# EAGLE design modularArduinoClouds3 (EAGLE 9.1.0)
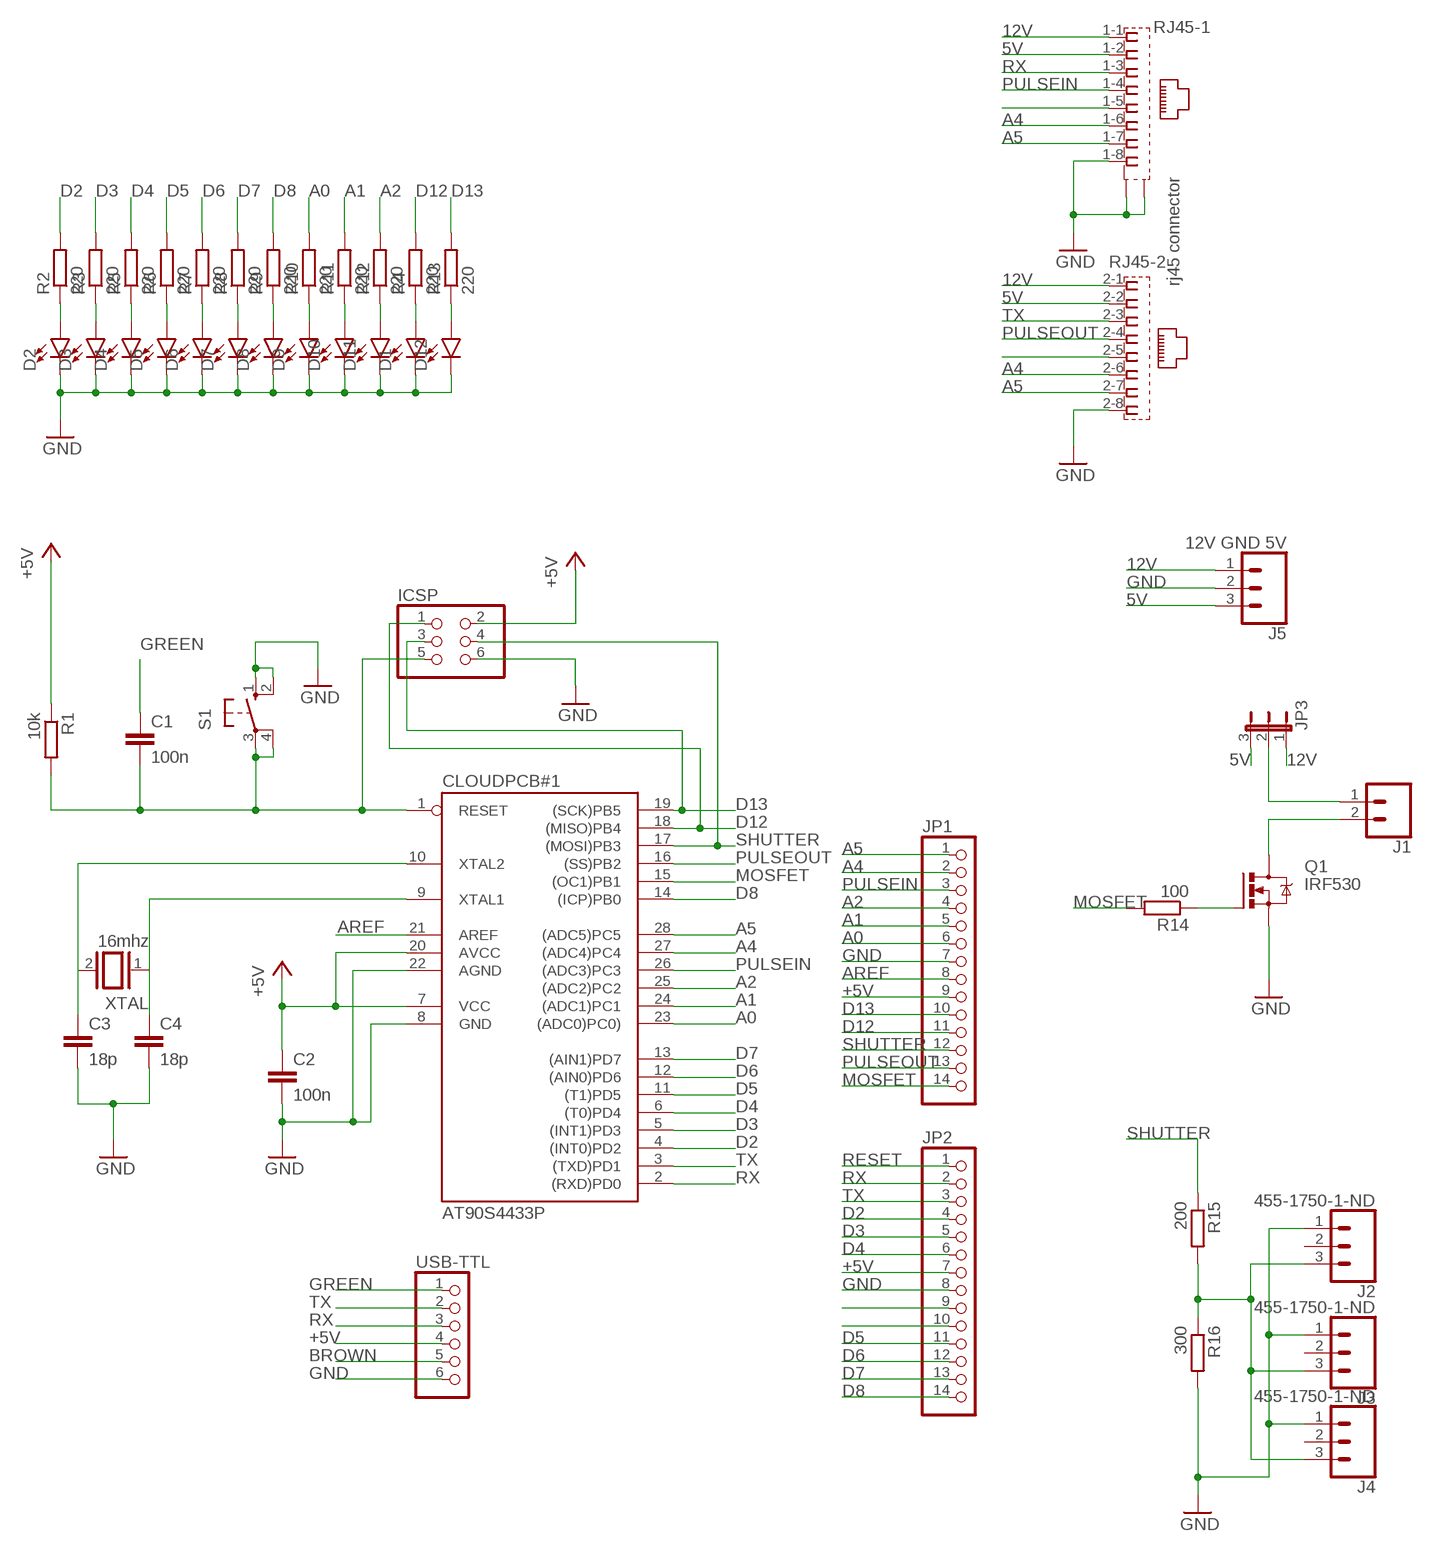
[diagram p0: schematic, sheet 1]

## Parts
C1  100n  C-EU050-025X075  [C050-025X075]
C2  100n  C-EU050-025X075  [C050-025X075]
C3  18p  C-EU050-025X075  [C050-025X075]
C4  18p  C-EU050-025X075  [C050-025X075]
CLOUDPCB#1  AT90S4433P  [DIL28-3]
D1  LED5MM  [LED_5MM]
D2  LED5MM  [LED_5MM]
D3  LED5MM  [LED_5MM]
D4  LED5MM  [LED_5MM]
D5  LED5MM  [LED_5MM]
D6  LED5MM  [LED_5MM]
D7  LED5MM  [LED_5MM]
D8  LED5MM  [LED_5MM]
D9  LED5MM  [LED_5MM]
D10  LED5MM  [LED_5MM]
D11  LED5MM  [LED_5MM]
D12  LED5MM  [LED_5MM]
ICSP  PINHD-2X3  [2X03]
J1  CONN_02  [1X02]
J2  455-1750-1-ND  CONN_03  [1X03]
J3  455-1750-1-ND  CONN_03  [1X03]
J4  455-1750-1-ND  CONN_03  [1X03]
J5  12V GND 5V  CONN_03  [1X03]
JP1  PINHD-1X14  [1X14]
JP2  PINHD-1X14  [1X14]
JP3  JP2E  [JP2]
Q1  IRF530  [TO220BV]
R1  10k  R-EU_0207/10  [0207/10]
R2  220  R-EU_0207/10  [0207/10]
R3  220  R-EU_0207/10  [0207/10]
R4  220  R-EU_0207/10  [0207/10]
R5  220  R-EU_0207/10  [0207/10]
R6  220  R-EU_0207/10  [0207/10]
R7  220  R-EU_0207/10  [0207/10]
R8  220  R-EU_0207/10  [0207/10]
R9  220  R-EU_0207/10  [0207/10]
R10  220  R-EU_0207/10  [0207/10]
R11  220  R-EU_0207/10  [0207/10]
R12  220  R-EU_0207/10  [0207/10]
R13  220  R-EU_0207/10  [0207/10]
R14  100  R-EU_0207/10  [0207/10]
R15  200  R-EU_0207/10  [0207/10]
R16  300  R-EU_0207/10  [0207/10]
RJ45  557570-1  [557570-1]
S1  10-XX  [B3F-10XX]
USB-TTL  PINHD-1X6  [1X06]
XTAL  16mhz  XTAL/S  [QS]

## Nets
5V: J5.3 JP3.3 RJ45.1-2 RJ45.2-2
12V: J5.1 JP3.1 RJ45.1-1 RJ45.2-1
+5V: C2.1 CLOUDPCB#1.7(VCC) CLOUDPCB#1.20(AVCC) ICSP.2 JP1.9 JP2.7 R1.1 USB-TTL.4
A0: CLOUDPCB#1.23((ADC0)PC0)) JP1.6 R10.2
A1: CLOUDPCB#1.24((ADC1)PC1) JP1.5 R11.2
A2: CLOUDPCB#1.25((ADC2)PC2) JP1.4 R12.2
A4: CLOUDPCB#1.27((ADC4)PC4) JP1.2 RJ45.1-6 RJ45.2-6
A5: CLOUDPCB#1.28((ADC5)PC5) JP1.1 RJ45.1-7 RJ45.2-7
AREF: CLOUDPCB#1.21(AREF) JP1.8
BROWN: USB-TTL.5
D2: CLOUDPCB#1.4((INT0)PD2) JP2.4 R2.2
D3: CLOUDPCB#1.5((INT1)PD3) JP2.5 R3.2
D4: CLOUDPCB#1.6((T0)PD4) JP2.6 R5.2
D5: CLOUDPCB#1.11((T1)PD5) JP2.11 R6.2
D6: CLOUDPCB#1.12((AIN0)PD6) JP2.12 R7.2
D7: CLOUDPCB#1.13((AIN1)PD7) JP2.13 R8.2
D8: CLOUDPCB#1.14((ICP)PB0) JP2.14 R9.2
D12: CLOUDPCB#1.18((MISO)PB4) ICSP.1 JP1.11 R4.2
D13: CLOUDPCB#1.19((SCK)PB5) ICSP.3 JP1.10 R13.2
GND: C2.2 C3.2 C4.2 CLOUDPCB#1.8(GND) CLOUDPCB#1.22(AGND) D1.K(C) D2.K(C) D3.K(C) D4.K(C) D5.K(C) D6.K(C) D7.K(C) D8.K(C) D9.K(C) D10.K(C) D11.K(C) D12.K(C) ICSP.6 J2.1 J3.1 J4.1 J5.2 JP1.7 JP2.8 Q1.S R16.2 RJ45.1-8 RJ45.2-8 RJ45.G1(-1:S2) RJ45.G3(-1:S1) S1.1(S) S1.2(S1) USB-TTL.6
GREEN: C1.1 USB-TTL.1
MOSFET: CLOUDPCB#1.15((OC1)PB1) JP1.14 R14.2
N$1: D2.A R2.1
N$2: D3.A R3.1
N$3: C3.1 CLOUDPCB#1.10(XTAL2) XTAL.2
N$4: C4.1 CLOUDPCB#1.9(XTAL1) XTAL.1
N$5: RJ45.2-5
N$6: J1.2 Q1.D
N$7: D4.A R5.1
N$8: D5.A R6.1
N$9: D6.A R7.1
N$10: D7.A R8.1
N$11: D8.A R9.1
N$12: D9.A R10.1
N$13: D10.A R11.1
N$14: D11.A R12.1
N$15: JP2.9
N$16: JP2.10
N$18: Q1.G R14.1
N$19: J1.1 JP3.2
N$20: J2.3 J3.3 J4.3 R15.2 R16.1
N$28: RJ45.1-5
N$33: D1.A R4.1
N$35: D12.A R13.1
PULSEIN: CLOUDPCB#1.26((ADC3)PC3) JP1.3 RJ45.1-4
PULSEOUT: CLOUDPCB#1.16((SS)PB2) JP1.13 RJ45.2-4
RESET: C1.2 CLOUDPCB#1.1(RESET) ICSP.5 JP2.1 R1.2 S1.3(P) S1.4(P1)
RX: CLOUDPCB#1.2((RXD)PD0) JP2.2 RJ45.1-3 USB-TTL.3
SHUTTER: CLOUDPCB#1.17((MOSI)PB3) ICSP.4 JP1.12 R15.1
TX: CLOUDPCB#1.3((TXD)PD1) JP2.3 RJ45.2-3 USB-TTL.2
Unconnected: J2.2 J3.2 J4.2

## Notes on the sheet
- rj45 connector

## Library data of the parts
C1-C4 = rcl:C-EU: CAPACITOR, European symbol; SPICEPREFIX: C
CLOUDPCB#1 = atmel:AT90S4433: MICROCONTROLLER 4 Kbytes FLASH 128 bytes SRAM 256 bytes EEPROM UART 6-channel 10 bit ADC; OC_FARNELL: unknown; OC_NEWARK: unknown
D1-D12 = SparkFun-LED:LED: LED (Generic) Standard schematic elements and footprints for 5mm, 3mm, 1206, and 0603 sized LEDs. Generic LEDs with no color specified.; SPICEPREFIX: D
ICSP = SparkFun-Connectors:PINHD-2X3: PIN HEADER
J1 = SparkFun-Connectors:CONN_02: Multi connection point. Often used as Generic Header-pin footprint for 0.1 inch spaced/style header connections On any of the 0.1 inch spaced packages, you can populate with these: Break Away Headers - Straight <https://www.sparkfun.com/products/116> (PRT-00116) Break Away Male Headers - Right Angle <https://www.sparkfun.com/products/553> (PRT-00553) Female Headers <https://www.sparkfun.com/products/115> (PRT-00115) Break Away Headers - Machine Pin <https://www.sparkfun.com/products/117> (PRT-00117) Break Away Female Headers - Swiss Machine Pin <https://www.sparkfun.com/products/743> (PRT-00743) For SCREWTERMINALS and SPRING TERMINALS visit here: Screw Terimnals on SparkFun.com <https://www.sparkfun.com/search/results?term=Screw+Terminals> (5mm/3.5mm/2.54mm spacing) This device is also useful as a general connection point to wire up your design to another part of your project. Our various solder wires solder well into these plated through hole pads. Hook-Up Wire - Assortment (Stranded, 22 AWG) <https://www.sparkfun.com/products/11375> (PRT-11375) Hook-Up Wire - Assortment (Solid Core, 22 AWG) <https://www.sparkfun.com/products/11367> (PRT-11367) View the entire wire category on our website here <https://www.sparkfun.com/categories/141> Special notes: Molex polarized connector foot print use with: PRT-08233 with associated crimp pins and housings. 2.54_SCREWTERM for use with PRT-10571. 3.5mm Screw Terminal footprints for PRT-08084 5mm Screw Terminal footprints for use with PRT-08432
J2-J4 = SparkFun-Connectors:CONN_03: Multi connection point. Often used as Generic Header-pin footprint for 0.1 inch spaced/style header connections On any of the 0.1 inch spaced packages, you can populate with these: Break Away Headers - Straight <https://www.sparkfun.com/products/116> (PRT-00116) Break Away Male Headers - Right Angle <https://www.sparkfun.com/products/553> (PRT-00553) Female Headers <https://www.sparkfun.com/products/115> (PRT-00115) Break Away Headers - Machine Pin <https://www.sparkfun.com/products/117> (PRT-00117) Break Away Female Headers - Swiss Machine Pin <https://www.sparkfun.com/products/743> (PRT-00743) Stackable Header - 3 Pin (Female, 0.1") <https://www.sparkfun.com/products/13875> (PRT-13875) For SCREWTERMINALS and SPRING TERMINALS visit here: Screw Terimnals on SparkFun.com <https://www.sparkfun.com/search/results?term=Screw+Terminals> (5mm/3.5mm/2.54mm spacing) This device is also useful as a general connection point to wire up your design to another part of your project. Our various solder wires solder well into these plated through hole pads. Hook-Up Wire - Assortment (Stranded, 22 AWG) <https://www.sparkfun.com/products/11375> (PRT-11375) Hook-Up Wire - Assortment (Solid Core, 22 AWG) <https://www.sparkfun.com/products/11367> (PRT-11367) View the entire wire category on our website here <https://www.sparkfun.com/categories/141> Special notes: Molex polarized connector foot print use with SKU : PRT-08232 with associated crimp pins and housings.; PROD_ID: XXX-00000
J5 = SparkFun-Connectors:CONN_03: Multi connection point. Often used as Generic Header-pin footprint for 0.1 inch spaced/style header connections On any of the 0.1 inch spaced packages, you can populate with these: Break Away Headers - Straight <https://www.sparkfun.com/products/116> (PRT-00116) Break Away Male Headers - Right Angle <https://www.sparkfun.com/products/553> (PRT-00553) Female Headers <https://www.sparkfun.com/products/115> (PRT-00115) Break Away Headers - Machine Pin <https://www.sparkfun.com/products/117> (PRT-00117) Break Away Female Headers - Swiss Machine Pin <https://www.sparkfun.com/products/743> (PRT-00743) Stackable Header - 3 Pin (Female, 0.1") <https://www.sparkfun.com/products/13875> (PRT-13875) For SCREWTERMINALS and SPRING TERMINALS visit here: Screw Terimnals on SparkFun.com <https://www.sparkfun.com/search/results?term=Screw+Terminals> (5mm/3.5mm/2.54mm spacing) This device is also useful as a general connection point to wire up your design to another part of your project. Our various solder wires solder well into these plated through hole pads. Hook-Up Wire - Assortment (Stranded, 22 AWG) <https://www.sparkfun.com/products/11375> (PRT-11375) Hook-Up Wire - Assortment (Solid Core, 22 AWG) <https://www.sparkfun.com/products/11367> (PRT-11367) View the entire wire category on our website here <https://www.sparkfun.com/categories/141> Special notes: Molex polarized connector foot print use with SKU : PRT-08232 with associated crimp pins and housings.; PROD_ID: XXX-00000; VALUE: 455-1750-1-ND
JP1 JP2 = pinhead:PINHD-1X14: PIN HEADER
JP3 = jumper:JP2E: JUMPER
Q1 = transistor-power:IRF530: HEXFET Power MOSFET
R1-R16 = rcl:R-EU_: RESISTOR, European symbol; SPICEPREFIX: R
RJ45 = con-amp:557570-1: AMP connector
S1 = switch-omron:10-XX: OMRON SWITCH; MPN: B3F-1000; OC_FARNELL: 176432; OC_NEWARK: 36M3542
USB-TTL = pinhead:PINHD-1X6: PIN HEADER
XTAL = special:XTAL/S: CRYSTAL

## Board
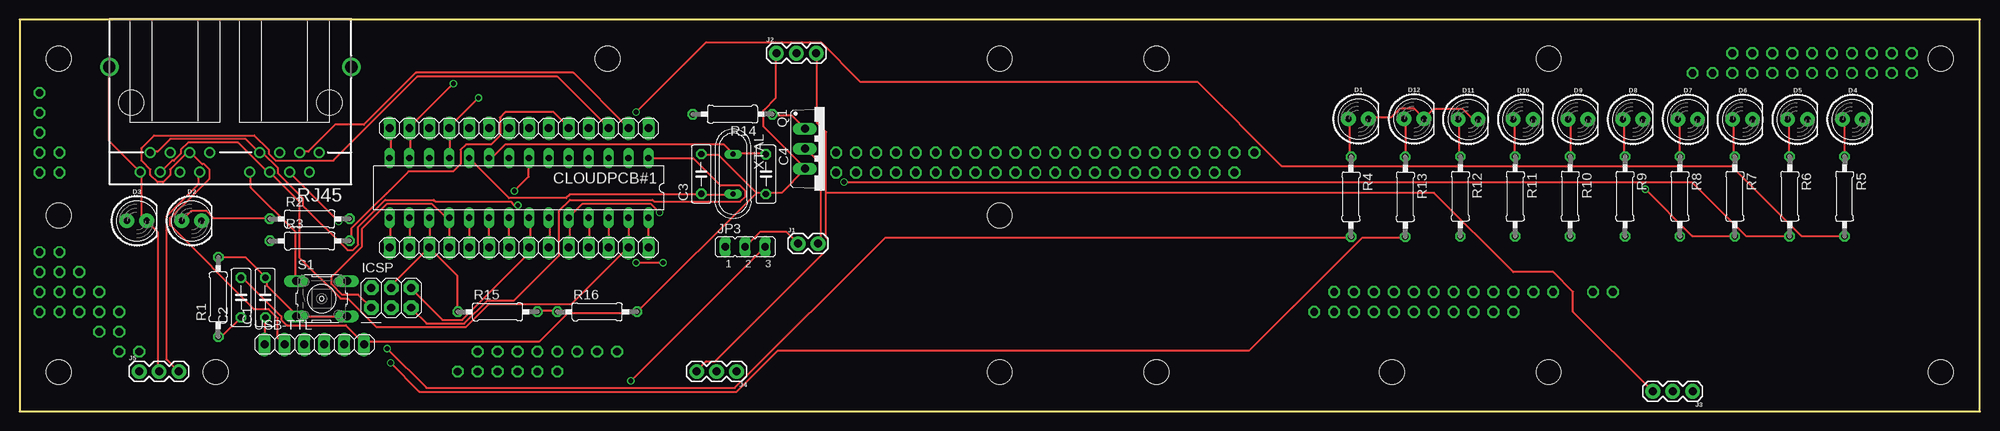
[diagram p1: board, top side]
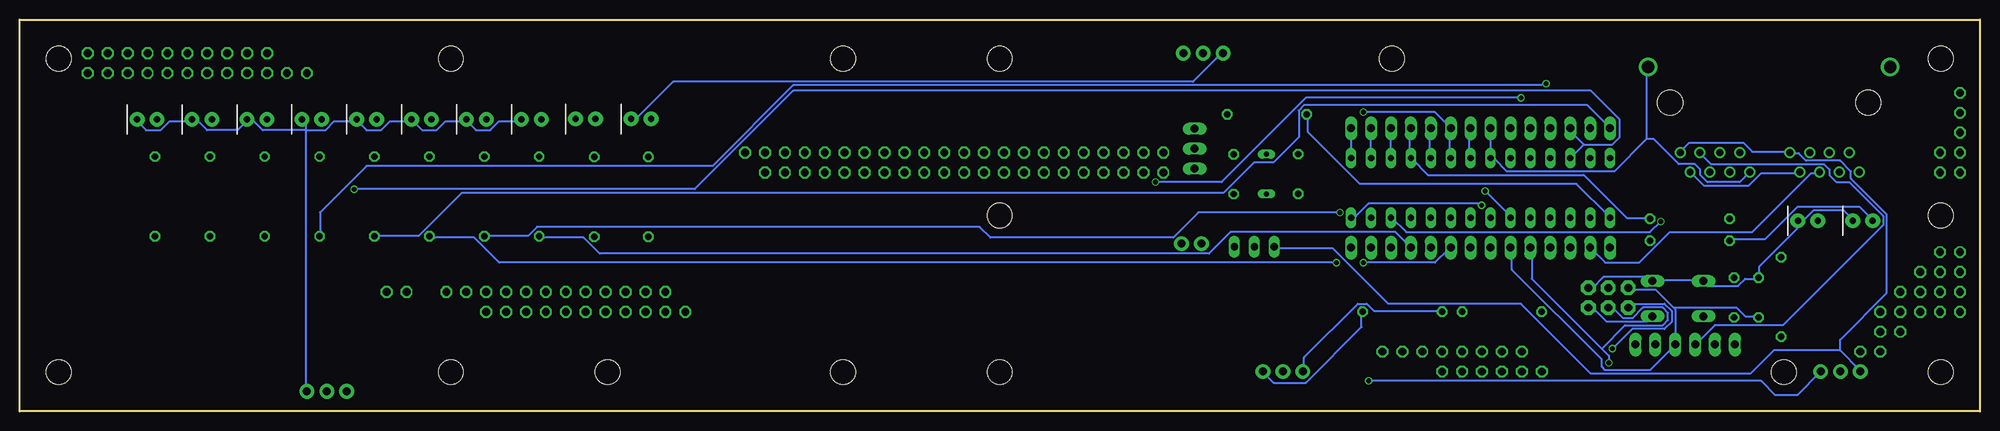
[diagram p2: board, bottom side, seen from below]

Size 250 x 50 mm. Coordinates in mm from the lower left corner, seen from the top.
Outline: 0,0 250,0
Outline: 250,0 250,50 0,50 0,0
Outline: 0,0 250,0
Copper layers (1*16): Top 0.035mm / dielectric 1.5mm / Bottom 0.035mm
Design rules "SeeedStudio_2layer_DRU_no_angle_20140221": minimum track width 6mil, minimum drill 12mil, track to track 6mil, track to pad 6mil, pad to pad 6mil, via to via 6mil, smd to smd 0mil, copper to edge 10mil, drill to drill 10mil, minimum pad ring 10mil, minimum via ring 6mil, stop-mask expansion 2mil, vias tented up to drill 100mil, thermal gap 10mil
Holes 3.2 mm at 5,5 5,25 5,45 125,5 125,25 125,45 245,5 245,45 195,45 75,45 195,5 175,5 25,5 145,5 145,45

### Footprints (pad centres in the part's own frame; a part is rotated, then mirrored left to right if it is on the bottom)
C050-025X075 = drill 0.813 octagon: 1 -2.54,0; 2 2.54,0
DIL28-3 = drill 0.813 long: 1 -16.51,-3.81; 2 -13.97,-3.81; 3 -11.43,-3.81; 4 -8.89,-3.81; 5 -6.35,-3.81; 6 -3.81,-3.81; 7 -1.27,-3.81; 8 1.27,-3.81; 9 3.81,-3.81; 10 6.35,-3.81; 11 8.89,-3.81; 12 11.43,-3.81; 13 13.97,-3.81; 14 16.51,-3.81; 15 16.51,3.81; 16 13.97,3.81; 17 11.43,3.81; 18 8.89,3.81; 19 6.35,3.81; 20 3.81,3.81; 21 1.27,3.81; 22 -1.27,3.81; 23 -3.81,3.81; 24 -6.35,3.81; 25 -8.89,3.81; 26 -11.43,3.81; 27 -13.97,3.81; 28 -16.51,3.81
LED_5MM = drill 0.813 pad 1.88: A -1.27,0; K 1.27,0
2X03 = drill 1.016 pad 1.88 octagon: 1 -2.54,-1.27; 2 -2.54,1.27; 3 0,-1.27; 4 0,1.27; 5 2.54,-1.27; 6 2.54,1.27
1X02 = drill 1.016 pad 1.88: 1 0,0; 2 2.54,0
1X03 = drill 1.016 pad 1.88: 1 0,0; 2 2.54,0; 3 5.08,0
1X14 = drill 1.016 long: 1 -16.51,0; 2 -13.97,0; 3 -11.43,0; 4 -8.89,0; 5 -6.35,0; 6 -3.81,0; 7 -1.27,0; 8 1.27,0; 9 3.81,0; 10 6.35,0; 11 8.89,0; 12 11.43,0; 13 13.97,0; 14 16.51,0
JP2 = drill 0.914 long: 1 -2.54,0; 2 0,0; 3 2.54,0
TO220BV = drill 1.016 long: D 0,-2.54; G -2.54,-2.54; S 2.54,-2.54
0207/10 = drill 0.813 octagon: 1 -5.08,0; 2 5.08,0
557570-1 = drill 0.889: 1-1 -11.43,6.35; 1-2 -10.16,8.89; 1-3 -8.89,6.35; 1-4 -7.62,8.89; 1-5 -6.35,6.35; 1-6 -5.08,8.89; 1-7 -3.81,6.35; 1-8 -2.54,8.89; 2-1 2.54,6.35; 2-2 3.81,8.89; 2-3 5.08,6.35; 2-4 6.35,8.89; 2-5 7.62,6.35; 2-6 8.89,8.89; 2-7 10.16,6.35; 2-8 11.43,8.89 | drill 1.575 pad 2.184: G1 -15.494,-4.572; G3 15.367,-4.572 | hole 3.251: -12.7,0; 12.573,0
B3F-10XX = drill 1.016 long: 1 -3.251,2.261; 2 3.251,2.261; 3 -3.251,-2.261; 4 3.251,-2.261
1X06 = drill 1.016 long: 1 -6.35,0; 2 -3.81,0; 3 -1.27,0; 4 1.27,0; 5 3.81,0; 6 6.35,0
QS = drill 0.61 long: 1 -2.54,0; 2 2.54,0

### Placement (x,y rotation side)
C1  31.34,14.52 90 top
C2  28.24,14.52 90 top
C3  86.94,30.29 90 top
C4  95.17,30.27 270 top
CLOUDPCB#1  63.68,28.51 180 top
D1  170.74,37.32 0 top
D2  21.94,24.32 0 top
D3  14.94,24.32 0 top
D4  233.74,37.26 0 top
D5  226.74,37.26 0 top
D6  219.74,37.26 0 top
D7  212.74,37.26 0 top
D8  205.74,37.26 0 top
D9  198.74,37.26 0 top
D10  191.74,37.26 0 top
D11  184.74,37.26 0 top
D12  177.82,37.32 0 top
ICSP  47.4,14.5 0 top
J1  99.28,21.4 0 top
J2  96.52,45.72 0 top
J3  213.36,2.54 180 top
J4  91.44,5.08 180 top
J5  15.24,5.08 0 top
JP1  63.68,20.89 180 top
JP2  63.68,36.13 180 top
JP3  92.54,21 0 top
Q1  102.68,33.52 270 top
R1  25.34,14.59 90 top
R2  37,24.56 0 top
R3  37,21.75 0 top
R4  169.8,27.38 270 top
R5  232.74,27.44 270 top
R6  225.74,27.44 270 top
R7  218.74,27.44 270 top
R8  211.74,27.44 270 top
R9  204.74,27.44 270 top
R10  197.74,27.44 270 top
R11  190.74,27.44 270 top
R12  183.74,27.44 270 top
R13  176.72,27.38 270 top
R14  90.92,37.92 180 top
R15  60.96,12.7 0 top
R16  73.66,12.7 0 top
RJ45  26.8,39.4 180 top
S1  38.51,14.38 0 top
USB-TTL  37.59,8.54 0 top
XTAL  91,30.29 270 top

### Tracks (layer width: path | path; a pad name or v marks a point on that pad's centre or on a via)
5V  (via drill 0.61)
  Top 0.254: v77.95,3.89 94.87,20.8 JP3.3 | RJ45.2-2 22.86,30.4 22.86,29.03 18.75,24.92 18.75,6.63 20.12,5.26 J5.3
  Bottom 0.254: RJ45.2-2 23.09,30.4 27.89,30.4 29.49,28.8 35.2,28.8 36.8,30.4 RJ45.1-2 | v77.95,3.89 27.89,3.89 26.06,2.06 23.32,2.06 20.34,5.03 J5.3
12V
  Bottom 0.254: RJ45.1-1 38.18,33.15 37.03,34.29 30.18,34.29 29.03,33.15 24.46,33.15 RJ45.2-1 24.23,32.92 23.09,32.92 22.17,32 17.83,32 16.46,30.63 16.46,29.72 11.89,25.15 11.89,15.09 17.83,9.14 17.83,7.77 | 17.83,7.77 26.29,7.77 29.26,4.8 49.61,4.8 58.52,13.72 75.44,13.72 82.53,20.8 89.84,20.8 JP3.1 | 17.83,7.77 15.32,5.26 J5.1
+5V  (via drill 0.61)
  Top 0.254: R1.1 25.38,9.6 25.83,9.6 28.12,11.89 C2.1 | CLOUDPCB#1.20 59.89,24.69 59.89,21.03 JP1.9 | v63.09,28.12 64.92,29.95 64.92,32.23 CLOUDPCB#1.7
  Bottom 0.254: CLOUDPCB#1.7 65.15,32.46 65.15,36.12 JP2.7 | 39.09,13.26 41.38,15.54 44.81,15.54 ICSP.2 | 39.09,13.26 38.86,13.03 38.86,8.69 USB-TTL.4 38.86,8.46 42.06,5.26 47.78,5.26 48.23,5.71 48.23,6.63 59.66,18.06 59.66,20.8 JP1.9 | v63.09,28.12 59.89,24.92 CLOUDPCB#1.20 | 39.09,13.26 31.09,13.26 29.95,12.12 28.35,12.12 C2.1
A0  (via drill 0.61)
  Top 0.254: CLOUDPCB#1.23 67.67,24.69 67.67,21.03 JP1.6 | v78.64,18.97 v82.07,18.97
  Bottom 0.254: v82.07,18.97 188.82,18.97 192.02,22.17 197.74,22.17 R10.2 | v78.64,18.97 69.49,18.97 67.67,20.8 JP1.6
A1  (via drill 0.61)
  Top 0.254: JP1.5 70.18,21.03 70.18,24.69 CLOUDPCB#1.24 70.18,24.92 71.78,26.52 80.47,26.52 v81.61,25.38
  Bottom 0.254: v81.61,25.38 99.67,25.38 102.87,22.17 126.19,22.17 127.56,23.55 184.02,23.55 185.17,22.4 190.65,22.4 R11.2
A2
  Top 0.254: CLOUDPCB#1.25 72.69,24.69 72.69,21.03 JP1.4
  Bottom 0.254: R12.2 183.57,22.17 178.08,22.17 176.02,20.12 98.3,20.12 95.56,22.86 74.52,22.86 72.69,21.03 JP1.4
A4
  Top 0.254: CLOUDPCB#1.27 77.72,24.69 77.72,21.03 JP1.2 77.5,20.8 70.41,13.72 59.89,13.72 56.92,10.74 45.49,10.74 41.83,14.4 40.92,14.4 35.66,19.66 35.66,26.75 32,30.4 RJ45.1-6 31.77,30.4 27.89,34.29 21.49,34.29 20.57,33.38 20.57,32.92 19.66,32 19.43,32 18.06,30.63 RJ45.2-6
A5  (via drill 0.61)
  Top 0.254: CLOUDPCB#1.28 80.24,24.69 80.24,21.03 JP1.1 | RJ45.2-7 16.69,33.15 17.6,33.15 19.2,34.75 28.8,34.75 30.4,33.15 RJ45.1-7 30.63,32.92 31.09,32.92 32.92,31.09 32.92,30.4 36.12,27.2 36.12,26.29 41.83,20.57 42.52,20.57 43.2,21.26 43.2,23.55 46.63,26.98 52.81,26.98 53.03,26.75 62.64,26.75 63.09,26.29 v63.55,26.29
  Bottom 0.254: v63.55,26.29 63.78,26.52 77.95,26.52 79.55,24.92 80.01,24.92 CLOUDPCB#1.28
AREF
  Top 0.254: CLOUDPCB#1.21 62.41,21.03 JP1.8
D2
  Bottom 0.254: R2.2 42.29,24.69 45.03,24.69 50.52,30.18 70.41,30.18 72.47,32.23 CLOUDPCB#1.4 72.69,32.46 72.69,36.12 JP2.4
D3
  Top 0.254: R3.2 42.29,21.95 42.29,23.32 49.61,30.63 55.32,30.63 56.24,31.55 56.24,33.38 56.92,34.06 60.12,34.06 61.27,35.2 61.27,37.49 61.95,38.18 68.12,38.18 69.95,36.35 JP2.5
  Bottom 0.254: CLOUDPCB#1.5 70.18,32.46 70.18,36.12 JP2.5
D4  (via drill 0.61)
  Top 0.254: v78.64,38.18 87.55,47.09 102.18,47.09 107.21,42.06 150.19,42.06 160.93,31.32 218.31,31.32 227.23,22.4 232.72,22.4 R5.2
  Bottom 0.254: v78.64,38.18 69.49,38.18 67.67,36.35 JP2.6 67.67,36.12 67.67,32.46 CLOUDPCB#1.6
D5  (via drill 0.61)
  Top 0.254: v105.16,29.26 213.28,29.26 220.14,22.4 225.63,22.4 R6.2 | v58.52,40.01 54.86,36.35 JP2.11 54.86,36.12 54.86,32.46 CLOUDPCB#1.11
  Bottom 0.254: v105.16,29.26 96.7,29.26 85.95,40.01 v58.52,40.01
D6  (via drill 0.61)
  Top 0.254: v207.34,28.35 213.28,22.4 218.54,22.4 R7.2
  Bottom 0.254: v207.34,28.35 163.91,28.35 151.33,40.92 49.61,40.92 45.95,37.26 45.95,34.98 46.86,34.06 50.52,34.06 | 50.52,34.06 52.12,32.46 CLOUDPCB#1.12 | 50.52,34.06 52.12,35.66 52.12,36.12 JP2.12
D7  (via drill 0.61)
  Top 0.254: v55.32,41.83 49.84,36.35 JP2.13 49.84,36.12 49.84,32.46 CLOUDPCB#1.13
  Bottom 0.254: v55.32,41.83 55.55,41.6 151.33,41.6 161.62,31.32 205.74,31.32 211.68,25.38 211.68,22.4 R8.2
D8
  Top 0.254: CLOUDPCB#1.14 47.32,32.46 47.32,36.12 JP2.14
  Bottom 0.254: R9.2 204.6,22.4 199.11,22.4 193.62,27.89 96.47,27.89 92.58,31.77 90.07,31.77 86.87,34.98 86.87,38.41 86.18,39.09 50.06,39.09 47.32,36.35 JP2.14
D12  (via drill 0.61)
  Top 0.254: JP1.11 54.86,21.03 54.86,24.69 CLOUDPCB#1.18 54.63,24.92 54.18,24.92 52.58,26.52 46.86,26.52 43.66,23.32 43.66,21.03 39.78,17.14 39.78,16.23 41.15,14.86 43.2,14.86 44.81,13.26 ICSP.1 | v46.86,8 51.89,2.97 91.21,2.97 110.41,22.17 169.62,22.17 R4.2
  Bottom 0.254: v46.86,8 44.35,10.52 40.23,10.52 39.32,11.43 39.32,12.8 40.23,13.72 44.35,13.72 44.81,13.26 ICSP.1
D13  (via drill 0.61)
  Top 0.254: v47.32,6.17 50.98,2.52 91.44,2.52 96.7,7.77 156.82,7.77 171.22,22.17 176.71,22.17 R13.2 | CLOUDPCB#1.19 57.38,24.69 57.38,21.03 JP1.10
  Bottom 0.254: v47.32,6.17 47.32,7.09 48.23,8 | 48.23,8 57.15,16.92 57.15,20.8 JP1.10 | 48.23,8 45.26,10.97 40.46,10.97 39.78,11.66 39.78,12.57 40.46,13.26 42.98,13.26 44.35,11.89 45.49,11.89 46.63,13.03 47.32,13.03 ICSP.3
GND
  Top 0.254: D11.K 185.85,37.26 185.4,37.26 184.02,38.63 180.37,38.63 179.22,37.49 D12.K 178.99,37.49 177.85,38.63 176.02,38.63 174.88,37.49 172.14,37.49 D1.K | 93.95,27.89 89.15,32.69 87.1,32.69 C3.2 | 93.95,27.89 95.1,27.89 C4.2 95.33,27.89 97.16,27.89 100.13,30.86 Q1.S 100.13,31.09 94.87,36.35 94.87,38.41 96.47,40.01 96.47,45.72 J2.1 | 93.95,27.89 78.87,12.8 R16.2 78.64,12.57 69.95,12.57 66.29,8.91 44.35,8.91 44.12,8.69 USB-TTL.6 43.89,8.69 41.6,10.97 34.06,10.97 33.38,11.66 33.38,12.12 28.35,17.14 C2.2 | J5.2 17.6,5.26 17.6,22.86 16.23,24.23 D3.K 16,24.46 15.54,24.92 15.54,30.4 RJ45.2-8 15.32,30.63 11.43,34.52 11.43,43.89 RJ45.G3 | CLOUDPCB#1.22 65.15,24.69 65.15,21.03 JP1.7 64.92,20.8 64.92,20.12 56.46,11.66 53.95,11.66 50.06,15.54 ICSP.6 | RJ45.1-8 29.49,30.4 29.49,28.57 35.2,22.86 35.2,16.69 S1.1
  Bottom 0.254: D4.K 235,37.03 233.86,35.89 232.03,35.89 230.89,37.03 228.14,37.03 D5.K 227.91,37.03 227.23,37.03 226.09,35.89 222.2,35.89 221.06,37.03 D6.K 220.83,37.03 220.14,37.03 219,35.89 213.51,35.89 | 213.51,35.89 213.51,36.58 213.97,37.03 D7.K | 213.51,35.89 213.51,2.74 J3.1 | 213.51,35.89 211,35.89 209.85,37.03 207.11,37.03 D8.K 206.88,37.03 205.74,35.89 203.91,35.89 202.77,37.03 200.03,37.03 D9.K 199.8,37.03 198.65,35.89 196.82,35.89 195.68,37.03 193.17,37.03 D10.K 192.94,37.03 191.79,35.89 189.97,35.89 188.82,37.03 186.08,37.03 D11.K | R16.2 78.87,12.57 78.87,10.74 85.95,3.66 90.07,3.66 91.44,5.03 J4.1 | D3.K 16.23,24.46 17.37,25.6 21.26,25.6 22.4,24.46 23.09,24.46 D2.K 23.32,24.23 23.32,23.32 28.12,18.52 28.12,17.14 C2.2 28.35,16.92 29.95,16.92 30.86,16 34.75,16 35.2,16.46 S1.1 35.43,16.69 41.6,16.69 S1.2 41.83,16.69 42.29,17.14 48.01,17.14 49.38,15.77 49.84,15.77 ICSP.6 | JP2.8 62.41,36.12 62.41,32.46 CLOUDPCB#1.8 62.41,32.23 61.95,32.23 60.35,30.63 46.63,30.63 42.52,34.75 | 42.52,34.75 42.52,43.89 RJ45.G1 | 42.52,34.75 41.6,34.75 38.41,31.55 36.35,31.55 35.66,30.86 35.66,30.18 34.75,29.26 30.63,29.26 29.49,30.4 RJ45.1-8 | D1.K 171.91,37.49 171.22,37.49 166.65,42.06 100.36,42.06 96.7,45.72 J2.1
GREEN
  Top 0.254: C1.1 31.32,11.89 31.32,8.69 USB-TTL.1
MOSFET
  Top 0.254: CLOUDPCB#1.15 47.32,24.69 47.32,21.03 JP1.14
  Bottom 0.254: R14.2 85.72,37.72 85.72,35.66 79.1,29.03 51.44,29.03 47.32,24.92 CLOUDPCB#1.15
N$1
  Top 0.254: R2.1 31.77,24.69 24.69,24.69 23.77,25.6 21.95,25.6 20.8,24.46 D2.A
N$2
  Bottom 0.254: R3.1 31.77,21.95 27.43,21.95 23.32,26.06 15.32,26.06 13.72,24.46 D3.A
N$3
  Top 0.254: XTAL.2 90.98,27.66 87.1,27.66 C3.1 86.87,27.66 70.18,27.66 69.72,27.2 62.41,27.2 57.38,32.23 CLOUDPCB#1.10
N$4
  Top 0.254: C4.1 95.1,32.92 91.21,32.92 XTAL.1 90.98,32.92 89.84,34.06 61.95,34.06 60.35,32.46 59.89,32.46 CLOUDPCB#1.9
N$6
  Top 0.254: Q1.D 100.36,33.38 102.18,31.55 102.18,21.72 101.96,21.49 J1.2
N$7
  Top 0.254: R5.1 232.72,32.69 232.72,36.8 232.49,37.03 D4.A
N$8
  Top 0.254: R6.1 225.63,32.69 225.63,37.03 D5.A
N$9
  Top 0.254: R7.1 218.54,32.69 218.54,37.03 D6.A
N$10
  Top 0.254: R8.1 211.68,32.69 211.68,37.03 D7.A
N$11
  Top 0.254: R9.1 204.6,32.69 204.6,37.03 D8.A
N$12
  Top 0.254: R10.1 197.74,32.69 197.74,36.8 197.51,37.03 D9.A
N$13
  Top 0.254: R11.1 190.65,32.69 190.65,37.03 D10.A
N$14
  Top 0.254: R12.1 183.57,32.69 183.57,37.03 D11.A
N$17  (via drill 1 pad 0.55)
  other vias: 106.68,33.02
N$18
  Top 0.254: R14.1 96.01,37.72 98.53,37.72 100.13,36.12 Q1.G
N$19
  Top 0.254: JP3.2 92.58,21.03 94.41,22.86 97.84,22.86 99.21,21.49 J1.1
N$20
  Top 0.254: R15.2 66.06,12.8 68.58,12.8 R16.1 | 102.87,27.89 102.87,22.17 103.1,21.95 103.1,20.8 88.7,6.4 87.55,6.4 86.41,5.26 J4.3 | 102.87,27.89 102.87,35.66 101.73,36.8 101.73,45.72 J2.3 | J3.3 198.12,12.7 198.12,15.24 195.58,17.78 190.5,17.78 180.39,27.89 102.87,27.89
  Bottom 0.254: R16.1 68.58,12.8 77.27,12.8 78.18,13.72 79.32,13.72 86.18,6.86 86.18,5.26 J4.3
N$21  (via drill 1 pad 0.55)
  other vias: 2.54,40.64
N$22  (via drill 1 pad 0.55)
  other vias: 132.08,33.02
N$23  (via drill 1 pad 0.55)
  other vias: 144.78,33.02
N$24  (via drill 1 pad 0.55)
  other vias: 104.14,33.02
N$25  (via drill 1 pad 0.55)
  other vias: 119.38,33.02
N$26  (via drill 1 pad 0.55)
  other vias: 228.6,45.72
N$27  (via drill 1 pad 0.55)
  other vias: 241.3,45.72
N$29  (via drill 1 pad 0.55)
  other vias: 165.1,12.7
N$30  (via drill 1 pad 0.55)
  other vias: 167.64,12.7
N$31  (via drill 1 pad 0.55)
  other vias: 167.64,15.24
N$32  (via drill 1 pad 0.55)
  other vias: 170.18,15.24
N$33
  Top 0.254: R4.1 169.62,32.46 169.62,37.26 D1.A
N$34  (via drill 1 pad 0.55)
  other vias: 104.14,30.48
N$35
  Top 0.254: R13.1 176.71,32.46 176.71,37.26 D12.A
N$36  (via drill 1 pad 0.55)
  other vias: 177.8,15.24
N$37  (via drill 1 pad 0.55)
  other vias: 203.2,15.24
N$38  (via drill 1 pad 0.55)
  other vias: 172.72,12.7
N$39  (via drill 1 pad 0.55)
  other vias: 170.18,12.7
N$40  (via drill 1 pad 0.55)
  other vias: 172.72,15.24
N$41  (via drill 1 pad 0.55)
  other vias: 175.26,12.7
N$42  (via drill 1 pad 0.55)
  other vias: 175.26,15.24
N$43  (via drill 1 pad 0.55)
  other vias: 177.8,12.7
N$44  (via drill 1 pad 0.55)
  other vias: 180.34,12.7
N$45  (via drill 1 pad 0.55)
  other vias: 180.34,15.24
N$46  (via drill 1 pad 0.55)
  other vias: 182.88,15.24
N$47  (via drill 1 pad 0.55)
  other vias: 185.42,12.7
N$48  (via drill 1 pad 0.55)
  other vias: 182.88,12.7
N$49  (via drill 1 pad 0.55)
  other vias: 185.42,15.24
N$50  (via drill 1 pad 0.55)
  other vias: 187.96,12.7
N$51  (via drill 1 pad 0.55)
  other vias: 187.96,15.24
N$52  (via drill 1 pad 0.55)
  other vias: 190.5,12.7
N$53  (via drill 1 pad 0.55)
  other vias: 190.5,15.24
N$54  (via drill 1 pad 0.55)
  other vias: 193.04,15.24
N$55  (via drill 1 pad 0.55)
  other vias: 195.58,15.24
N$56  (via drill 1 pad 0.55)
  other vias: 200.66,15.24
N$57  (via drill 1 pad 0.55)
  other vias: 213.36,43.18
N$58  (via drill 1 pad 0.55)
  other vias: 215.9,43.18
N$59  (via drill 1 pad 0.55)
  other vias: 218.44,43.18
N$60  (via drill 1 pad 0.55)
  other vias: 218.44,45.72
N$61  (via drill 1 pad 0.55)
  other vias: 220.98,45.72
N$62  (via drill 1 pad 0.55)
  other vias: 223.52,43.18
N$63  (via drill 1 pad 0.55)
  other vias: 220.98,43.18
N$64  (via drill 1 pad 0.55)
  other vias: 223.52,45.72
N$65  (via drill 1 pad 0.55)
  other vias: 226.06,43.18
N$66  (via drill 1 pad 0.55)
  other vias: 228.6,43.18
N$67  (via drill 1 pad 0.55)
  other vias: 226.06,45.72
N$68  (via drill 1 pad 0.55)
  other vias: 231.14,43.18
N$69  (via drill 1 pad 0.55)
  other vias: 231.14,45.72
N$70  (via drill 1 pad 0.55)
  other vias: 233.68,43.18
N$71  (via drill 1 pad 0.55)
  other vias: 233.68,45.72
N$72  (via drill 1 pad 0.55)
  other vias: 236.22,43.18
N$73  (via drill 1 pad 0.55)
  other vias: 236.22,45.72
N$74  (via drill 1 pad 0.55)
  other vias: 238.76,43.18
N$75  (via drill 1 pad 0.55)
  other vias: 238.76,45.72
N$76  (via drill 1 pad 0.55)
  other vias: 241.3,43.18
N$77  (via drill 1 pad 0.55)
  other vias: 157.48,33.02
N$78  (via drill 1 pad 0.55)
  other vias: 154.94,30.48
N$79  (via drill 1 pad 0.55)
  other vias: 154.94,33.02
N$80  (via drill 1 pad 0.55)
  other vias: 152.4,30.48
N$81  (via drill 1 pad 0.55)
  other vias: 152.4,33.02
N$82  (via drill 1 pad 0.55)
  other vias: 147.32,30.48
N$83  (via drill 1 pad 0.55)
  other vias: 149.86,33.02
N$84  (via drill 1 pad 0.55)
  other vias: 147.32,33.02
N$85  (via drill 1 pad 0.55)
  other vias: 144.78,30.48
N$86  (via drill 1 pad 0.55)
  other vias: 142.24,30.48
N$87  (via drill 1 pad 0.55)
  other vias: 142.24,33.02
N$88  (via drill 1 pad 0.55)
  other vias: 139.7,30.48
N$89  (via drill 1 pad 0.55)
  other vias: 139.7,33.02
N$90  (via drill 1 pad 0.55)
  other vias: 137.16,30.48
N$91  (via drill 1 pad 0.55)
  other vias: 134.62,30.48
N$92  (via drill 1 pad 0.55)
  other vias: 137.16,33.02
N$93  (via drill 1 pad 0.55)
  other vias: 134.62,33.02
N$94  (via drill 1 pad 0.55)
  other vias: 132.08,30.48
N$95  (via drill 1 pad 0.55)
  other vias: 129.54,30.48
N$96  (via drill 1 pad 0.55)
  other vias: 129.54,33.02
N$97  (via drill 1 pad 0.55)
  other vias: 127,30.48
N$98  (via drill 1 pad 0.55)
  other vias: 127,33.02
N$99  (via drill 1 pad 0.55)
  other vias: 124.46,30.48
N$100  (via drill 1 pad 0.55)
  other vias: 124.46,33.02
N$101  (via drill 1 pad 0.55)
  other vias: 121.92,30.48
N$102  (via drill 1 pad 0.55)
  other vias: 121.92,33.02
N$103  (via drill 1 pad 0.55)
  other vias: 119.38,30.48
N$104  (via drill 1 pad 0.55)
  other vias: 116.84,30.48
N$105  (via drill 1 pad 0.55)
  other vias: 116.84,33.02
N$106  (via drill 1 pad 0.55)
  other vias: 114.3,30.48
N$107  (via drill 1 pad 0.55)
  other vias: 114.3,33.02
N$108  (via drill 1 pad 0.55)
  other vias: 111.76,30.48
N$109  (via drill 1 pad 0.55)
  other vias: 111.76,33.02
N$110  (via drill 1 pad 0.55)
  other vias: 109.22,30.48
N$111  (via drill 1 pad 0.55)
  other vias: 109.22,33.02
N$112  (via drill 1 pad 0.55)
  other vias: 106.68,30.48
N$113  (via drill 1 pad 0.55)
  other vias: 76.2,7.62
N$114  (via drill 1 pad 0.55)
  other vias: 73.66,7.62
N$115  (via drill 1 pad 0.55)
  other vias: 71.12,7.62
N$116  (via drill 1 pad 0.55)
  other vias: 66.04,5.08
N$117  (via drill 1 pad 0.55)
  other vias: 68.58,7.62
N$118  (via drill 1 pad 0.55)
  other vias: 68.58,5.08
N$119  (via drill 1 pad 0.55)
  other vias: 63.5,5.08
N$120  (via drill 1 pad 0.55)
  other vias: 66.04,7.62
N$121  (via drill 1 pad 0.55)
  other vias: 63.5,7.62
N$122  (via drill 1 pad 0.55)
  other vias: 60.96,5.08
N$123  (via drill 1 pad 0.55)
  other vias: 60.96,7.62
N$124  (via drill 1 pad 0.55)
  other vias: 58.42,7.62
N$125  (via drill 1 pad 0.55)
  other vias: 58.42,5.08
N$126  (via drill 1 pad 0.55)
  other vias: 55.88,5.08
N$127  (via drill 1 pad 0.55)
  other vias: 15.24,7.62
N$128  (via drill 1 pad 0.55)
  other vias: 12.7,7.62
N$129  (via drill 1 pad 0.55)
  other vias: 10.16,10.16
N$130  (via drill 1 pad 0.55)
  other vias: 12.7,10.16
N$131  (via drill 1 pad 0.55)
  other vias: 12.7,12.7
N$132  (via drill 1 pad 0.55)
  other vias: 7.62,12.7
N$133  (via drill 1 pad 0.55)
  other vias: 10.16,12.7
N$134  (via drill 1 pad 0.55)
  other vias: 10.16,15.24
N$135  (via drill 1 pad 0.55)
  other vias: 2.54,15.24
N$136  (via drill 1 pad 0.55)
  other vias: 7.62,15.24
N$137  (via drill 1 pad 0.55)
  other vias: 7.62,17.78
N$138  (via drill 1 pad 0.55)
  other vias: 2.54,17.78
N$139  (via drill 1 pad 0.55)
  other vias: 5.08,17.78
N$140  (via drill 1 pad 0.55)
  other vias: 5.08,20.32
N$141  (via drill 1 pad 0.55)
  other vias: 2.54,20.32
N$142  (via drill 1 pad 0.55)
  other vias: 5.08,15.24
N$143  (via drill 1 pad 0.55)
  other vias: 2.54,12.7
N$144  (via drill 1 pad 0.55)
  other vias: 5.08,12.7
N$145  (via drill 1 pad 0.55)
  other vias: 2.54,30.48
N$146  (via drill 1 pad 0.55)
  other vias: 5.08,30.48
N$147  (via drill 1 pad 0.55)
  other vias: 5.08,33.02
N$148  (via drill 1 pad 0.55)
  other vias: 2.54,33.02
N$149  (via drill 1 pad 0.55)
  other vias: 2.54,35.56
N$150  (via drill 1 pad 0.55)
  other vias: 2.54,38.1
N$151  (via drill 1 pad 0.55)
  other vias: 149.86,30.48
PULSEIN  (via drill 0.61)
  Top 0.254: CLOUDPCB#1.26 75.21,24.69 75.21,21.03 JP1.3 | v40.69,24.23 34.52,30.4 RJ45.1-4
  Bottom 0.254: v40.69,24.23 42.06,22.86 73.15,22.86 74.98,24.69 CLOUDPCB#1.26
PULSEOUT
  Top 0.254: CLOUDPCB#1.16 49.84,24.69 49.84,21.03 JP1.13
  Bottom 0.254: RJ45.2-4 20.57,30.4 21.49,30.4 29.03,22.86 39.55,22.86 43.43,18.97 47.78,18.97 49.61,20.8 JP1.13
RESET
  Top 0.254: R1.2 25.38,19.66 28.8,19.66 31.32,17.14 C1.2 31.55,16.92 31.55,16 35.2,12.34 S1.3 35.43,12.12 41.6,12.12 S1.4 | CLOUDPCB#1.1 80.24,32.23 85.95,32.23 89.38,28.8 91.9,28.8 92.58,28.12 92.58,27.43 91.9,26.75 80.92,26.75 80.7,26.98 70.18,26.98 68.81,25.6 68.81,19.89 63.09,14.17 59.66,14.17 56.69,11.2 51.89,11.2 50.06,13.03 ICSP.5
  Bottom 0.254: CLOUDPCB#1.1 80.24,32.46 80.24,36.12 JP2.1 | ICSP.5 49.84,13.03 49.15,13.03 47.55,11.43 42.52,11.43 41.83,12.12 S1.4
RX
  Top 0.254: RJ45.1-3 35.89,33.15 36.8,33.15 40.23,36.58 43.89,36.58 50.52,43.2 70.64,43.2 77.5,36.35 JP2.2
  Bottom 0.254: CLOUDPCB#1.2 77.72,32.46 77.72,36.12 JP2.2 | USB-TTL.3 36.12,8.69 33.83,10.97 25.15,10.97 12.34,23.77 12.34,24.92 16.69,29.26 18.29,29.26 19.2,30.18 19.2,30.86 19.89,31.55 34.29,31.55 35.66,32.92 RJ45.1-3
SHUTTER
  Top 0.254: R15.1 55.78,12.8 55.78,17.37 52.35,20.8 JP1.12 | CLOUDPCB#1.17 52.35,24.69 52.35,21.03 JP1.12 | ICSP.4 47.55,15.77 47.55,16.23 52.12,20.8 JP1.12
TX
  Top 0.254: USB-TTL.2 33.6,8.69 32.92,9.37 32.92,11.89 31.77,13.03 29.95,13.03 19.2,23.77 19.2,24.69 24.23,29.72 24.23,30.86 23.55,31.55 23.32,31.55 21.95,32.92 RJ45.2-3 21.72,32.92 21.26,32.92 19.2,30.86 19.2,30.18 18.29,29.26 17.6,29.26 16.69,30.18 16.69,30.86 15.54,32 15.54,33.6 17.14,35.2 29.95,35.2 31.77,33.38 31.77,32.92 32.69,32 40.01,32 50.75,42.75 68.58,42.75 74.98,36.35 JP2.3
  Bottom 0.254: CLOUDPCB#1.3 75.21,32.46 75.21,36.12 JP2.3